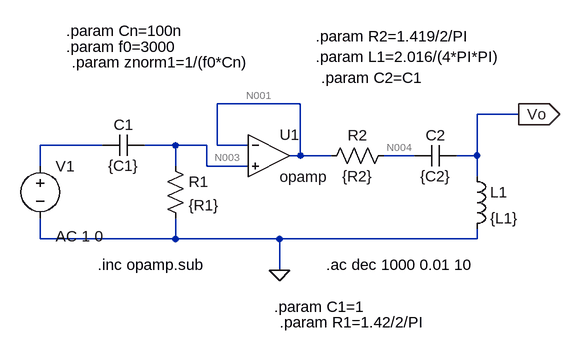
[diagram p0: schematic Res_pto1_pasivo.asc]
Res_pto1_pasivo.asc, the LTspice schematic file:
Version 4
SHEET 1 1328 680
WIRE 224 32 96 32
WIRE 560 48 496 48
WIRE -80 96 -176 96
WIRE 32 96 -16 96
WIRE 80 96 32 96
WIRE 96 96 96 32
WIRE 144 96 96 96
WIRE 224 112 224 32
WIRE 224 112 208 112
WIRE 272 112 224 112
WIRE 400 112 352 112
WIRE 496 112 496 48
WIRE 496 112 464 112
WIRE -176 128 -176 96
WIRE 32 128 32 96
WIRE 80 128 80 96
WIRE 144 128 80 128
WIRE 496 144 496 112
WIRE -176 240 -176 208
WIRE 32 240 32 208
WIRE 32 240 -176 240
WIRE 192 240 32 240
WIRE 496 240 496 224
WIRE 496 240 192 240
WIRE 192 288 192 240
FLAG 192 288 0
FLAG 560 48 Vo
IOPIN 560 48 Out
SYMBOL res 368 96 R90
WINDOW 0 0 56 VBottom 2
WINDOW 3 32 56 VTop 2
SYMATTR InstName R2
SYMATTR Value {R2}
SYMBOL ind 480 128 R0
SYMATTR InstName L1
SYMATTR Value {L1}
SYMBOL cap 464 96 R90
WINDOW 0 0 32 VBottom 2
WINDOW 3 32 32 VTop 2
SYMATTR InstName C2
SYMATTR Value {C2}
SYMBOL voltage -176 112 R0
WINDOW 123 24 124 Left 2
WINDOW 39 0 0 Left 0
SYMATTR Value2 AC 1 0
SYMATTR InstName V1
SYMATTR Value ""
SYMBOL OpAmps\\opamp 176 48 R0
SYMATTR InstName U1
SYMBOL cap -16 80 R90
WINDOW 0 0 32 VBottom 2
WINDOW 3 32 32 VTop 2
SYMATTR InstName C1
SYMATTR Value {C1}
SYMBOL res 16 112 R0
SYMATTR InstName R1
SYMATTR Value {R1}
TEXT 264 280 Left 2 !.ac dec 1000 0.01 10
TEXT -88 280 Left 2 !.inc opamp.sub
TEXT 248 -40 Left 2 !.param L1=2.016/(4*PI*PI)
TEXT 248 -72 Left 2 !.param R2=1.419/2/PI
TEXT 256 -8 Left 2 !.param C2=C1
TEXT -136 -80 Left 2 !.param Cn=100n
TEXT -136 -56 Left 2 !.param f0=3000
TEXT -128 -32 Left 2 !.param znorm1=1/(f0*Cn)
TEXT 184 344 Left 2 !.param C1=1
TEXT 192 368 Left 2 !.param R1=1.42/2/PI

The netlist it stands for:
* Res_pto1_pasivo.asc
R2 N004 N001 {R2}
L1 Vo 0 {L1}
C2 Vo N004 {C2}
V1 N002 0 AC 1 0
XU1 N001 N003 N001 opamp Aol=100K GBW=10Meg  ; pins invin noninvin out
C1 N003 N002 {C1}
R1 N003 0 {R1}
.ac dec 1000 0.01 10
.inc opamp.sub
.param L1=2.016/(4*PI*PI)
.param R2=1.419/2/PI
.param C2=C1
.param Cn=100n
.param f0=3000
.param znorm1=1/(f0*Cn)
.param C1=1
.param R1=1.42/2/PI
.backanno
.end

* Results of the author's LTspice run, read from the files saved beside the schematic
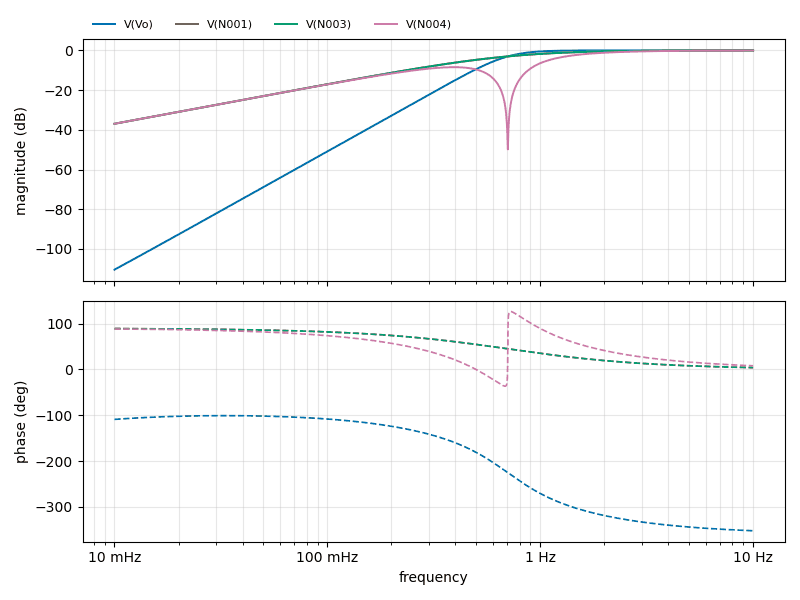
[diagram p1: AC Analysis of Res_pto1_pasivo.asc, plotted from the saved traces]
* AC Analysis, 1 run:
*   V(Vo): -110.46 dB at 10 mHz, -0.00 dB at 10 Hz, peak -0.00 dB at 10 Hz, 3 dB below the peak at 706.1 mHz
*   V(N001): -36.96 dB at 10 mHz, -0.02 dB at 10 Hz, peak -0.02 dB at 10 Hz, 3 dB below the peak at 700.8 mHz
*   V(N003): -36.96 dB at 10 mHz, -0.02 dB at 10 Hz, peak -0.02 dB at 10 Hz, 3 dB below the peak at 700.8 mHz
*   V(N004): -36.96 dB at 10 mHz, -0.04 dB at 10 Hz, peak -0.04 dB at 10 Hz, 3 dB below the peak at 1.314 Hz